# Altium schematic sheet Range_Front.SchDoc
size A
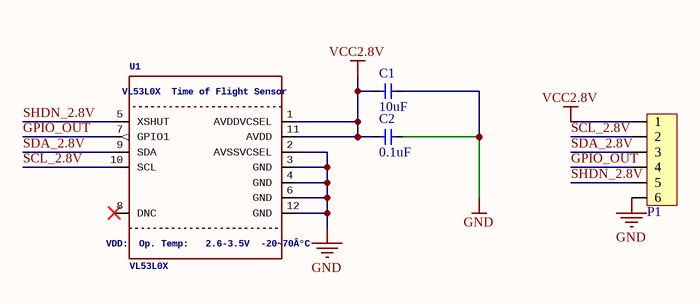
[diagram p0: Range_Front.SchDoc]

## Parts
C1  value 10uF  [CAP_0805]  (hidden comment: Cap_0805)
C2  value 0.1uF  [CAP_0603]  (hidden comment: Cap_0603)
P1  HDR1x6_1.27  [HDR1X6_1.27_180H_SMD]  (value not drawn)
U1  VL53L0X  VL53L0X
TimeofFlightSensor: VL53L0X / Time of Flight Sensor  VDD:
Op.Temp: VDD: / Op. Temp:  2.6-3.5V
-20~70Â°C: 2.6-3.5V / -20~70Â°C  [LGA12_ST_4.4X2.4X1MM]

## Nets
GND: C1.1 C2.1 P1.6 U1.2(AVSSVCSEL) U1.3(GND) U1.4(GND) U1.6(GND) U1.12(GND)
VCC2.8V: C1.2 C2.2 P1.1 U1.1(AVDDVCSEL) U1.11(AVDD)
GPIO_OUT: P1.4 U1.7(GPIO1)
SCL_2.8V: P1.2 U1.10(SCL)
SDA_2.8V: P1.3 U1.9(SDA)
SHDN_2.8V: P1.5 U1.5(XSHUT)

Not connected (* = marked no-connect by the designer): U1 8(DNC)*

## Library data of the parts
C1 = Cap_0805: Capacitor
C2 = Cap_0603: Capacitor
P1 = HDR1x6_1.27: Header
U1 = VL53L0X: VL53L0X - Laser Time of Flight Sensor (2M range)